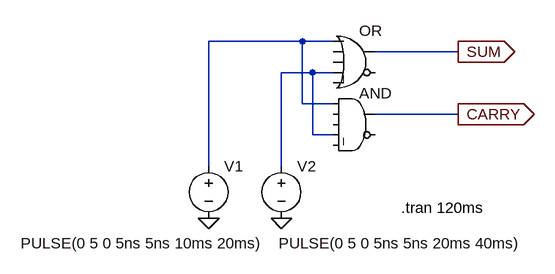
[diagram p0: schematic Half adder.asc]
Half adder.asc, the LTspice schematic file:
Version 4
SHEET 1 880 680
WIRE 304 64 160 64
WIRE 352 64 304 64
WIRE 544 80 416 80
WIRE 320 112 272 112
WIRE 352 112 320 112
WIRE 304 160 304 64
WIRE 352 160 304 160
WIRE 544 176 416 176
WIRE 320 208 320 112
WIRE 352 208 320 208
WIRE 160 256 160 64
WIRE 272 256 272 112
FLAG 160 336 0
FLAG 272 336 0
FLAG 544 80 SUM
IOPIN 544 80 Out
FLAG 544 176 CARRY
IOPIN 544 176 Out
SYMBOL Digital\\and 384 128 R0
SYMATTR InstName AND
SYMBOL Digital\\or 384 32 R0
SYMATTR InstName OR
SYMBOL voltage 160 240 R0
WINDOW 3 -289 135 Left 2
WINDOW 123 0 0 Left 0
WINDOW 39 0 0 Left 0
SYMATTR InstName V1
SYMATTR Value PULSE(0 5 0 5ns 5ns 10ms 20ms)
SYMBOL voltage 272 240 R0
WINDOW 3 -4 135 Left 2
WINDOW 123 0 0 Left 0
WINDOW 39 0 0 Left 0
SYMATTR InstName V2
SYMATTR Value PULSE(0 5 0 5ns 5ns 20ms 40ms)
TEXT 456 320 Left 2 !.tran 120ms

The netlist it stands for:
* Half adder.asc
AND N001 0 0 N002 0 0 CARRY 0 AND
A§OR N001 0 0 N002 0 0 SUM 0 OR
V1 N001 0 PULSE(0 5 0 5ns 5ns 10ms 20ms)
V2 N002 0 PULSE(0 5 0 5ns 5ns 20ms 40ms)
.tran 120ms
.backanno
.end